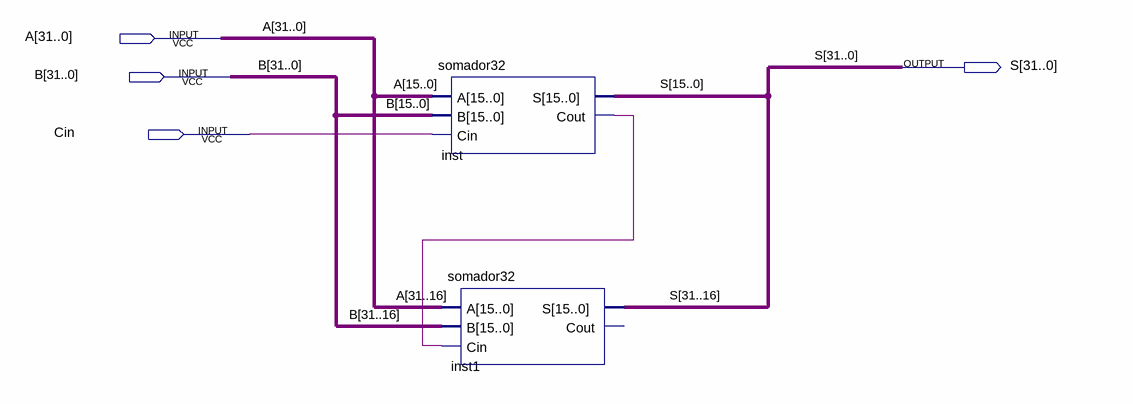
[diagram p0: schematic sheet]
// Quartus schematic somador64.bdf as structural Verilog: 2 symbols, 4 pins
module somador64 (
  input  [31:0] A,
  input  [31:0] B,
  input  Cin,
  output [31:0] S
);

  wire inst_cout;

  somador32 inst (.A(A[15:0]), .B(B[15:0]), .Cin(Cin), .S(S[15:0]), .Cout(inst_cout));
  somador32 inst1 (.A(A[31:16]), .B(B[31:16]), .Cin(inst_cout), .S(S[31:16]));  // open: Cout
endmodule
